# Altium schematic sheet power-path-control.SchDoc
size A4
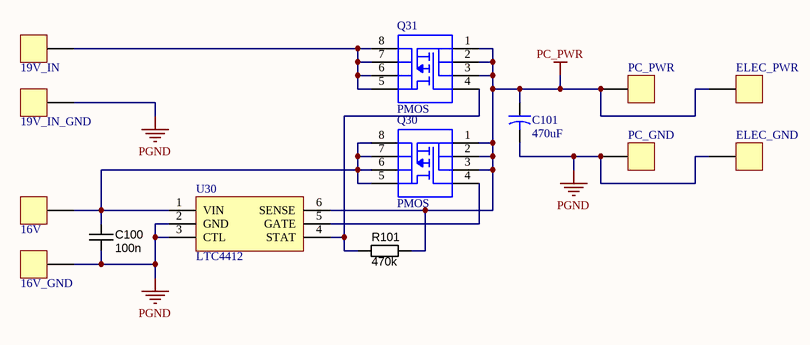
[diagram p0: power-path-control.SchDoc]

## Parts
16V  HEADER-1  [POWER-PAD-4x3]  (value not drawn)
16V_GND  HEADER-1  [POWER-PAD-4x3]  (value not drawn)
19V_IN  HEADER-1  [POWER-PAD-4x3]  (value not drawn)
19V_IN_GND  HEADER-1  [POWER-PAD-4x3]  (value not drawn)
C100  100n  [CAPC1608X90N]
C101  470uF  [CAPR5-4X5]
ELEC_GND  HEADER-1  [POWER-PAD-4x3]  (value not drawn)
ELEC_PWR  HEADER-1  [POWER-PAD-4x3]  (value not drawn)
PC_GND  HEADER-1  [POWER-PAD-4x3]  (value not drawn)
PC_PWR  HEADER-1  [POWER-PAD-4x3]  (value not drawn)
Q30  PMOS  [SO8]
Q31  PMOS  [SO8]
R101  470k  [RESC1608N_ZERO]
U30  LTC4412  [TSOT-23-6]

## Nets
PC_PWR: C101.1 ELEC_PWR.1 PC_PWR.1 Q30.1 Q30.2 Q30.3 Q31.1 Q31.2 Q31.3 R101.1 U30.6(SENSE)
PGND: 16V_GND.1 19V_IN_GND.1 C100.2 C101.2 ELEC_GND.1 PC_GND.1 U30.2(GND) U30.3(CTL)
Net16V_1: 16V.1 C100.1 Q30.5 Q30.6 Q30.7 Q30.8 U30.1(VIN)
Net19V_IN_1: 19V_IN.1 Q31.5 Q31.6 Q31.7 Q31.8
NetQ30_4: Q30.4 U30.5(GATE)
NetQ31_4: Q31.4 R101.2 U30.4(STAT)

## Library data of the parts
C100 = CAPC_10n_0603_X7R_50V_10%: Capacitor SMD Cer 10nF 10% 50V X7R 0603; Manufacturer 1: TDK Corporation; Manufacturer Part Number 1: C1608X7R1H103K; Ratings: 50V; X7R; Material: ceramic; SCDType: spec; Value: 10n; Package / Case: 0603 (1608 metric); Tolerance: ±10%; Supplier 1: Digi-Key; Supplier Part Number 1: 445-1311-1-ND; ComponentLink1URL: http://product.tdk.com/capacitor/mlcc/en/documents/mlcc_commercial_general_en.pdf; ComponentLink1Description: http://product.tdk.com/capacitor/mlcc/en/documents/mlcc_commercial_general_en.pdf; Supplier 2: Digi-Key; Supplier Part Number 2: 478-1227-1-ND; Manufacturer 2: AVX Corporation; Manufacturer Part Number 2: 06035C103KAT2A; ComponentLink2URL: http://www.avx.com/docs/Catalogs/cx7r.pdf; ComponentLink2Description: http://www.avx.com/docs/Catalogs/cx7r.pdf
C101 = Cap2: Capacitor; Value: 100pF; Published: 23-Sep-2002; PackageReference: CAPR5-4X5; Publisher: Altium Limited; PackageDescription: Capacitor; 2 Leads
R101 = RES_0R_0603: Resistor SMD chip 0.0 Ohm 0.1W 0603; Manufacturer 1: Vishay/Dale; Manufacturer Part Number 1: CRCW06030000Z0EA; Tolerance: ±5%; Ratings: 1/10W; SCDType: spec; Value: 0R; Package / Case: 0603 (1608metric); Supplier 1: Digi-Key; Supplier Part Number 1: 541-0.0GCT-ND; ComponentLink1URL: http://www.vishay.com/doc?20035; ComponentLink1Description: http://www.vishay.com/doc?20035; Supplier 2: Digi-Key; Supplier Part Number 2: P0.0GTR-ND; Manufacturer 2: Panasonic Electronic Components; Manufacturer Part Number 2: ERJ-3GEY0R00V; RoHS 2: RoHS Compliant; ComponentLink2URL: http://industrial.panasonic.com/www-cgi/jvcr13pz.cgi?E+PZ+3+AOA0001+ERJ3GEY0R00V+7+WW; ComponentLink2Description: http://industrial.panasonic.com/www-cgi/jvcr13pz.cgi?E+PZ+3+AOA0001+ERJ3GEY0R00V+7+WW; Supplier 3: Digi-Key; Supplier Part Number 3: 311-0.0LECT-ND; Manufacturer 3: Yageo; Manufacturer Part Number 3: AC0603JR-070RL; RoHS 3: RoHS Compliant; ComponentLink3URL: http://www.yageo.com/documents/recent/PYu-AC_51_RoHS_L_2.pdf; ComponentLink3Description: http://www.yageo.com/documents/recent/PYu-AC_51_RoHS_L_2.pdf